# EAGLE design Main_Brd (EAGLE 9.7.0)
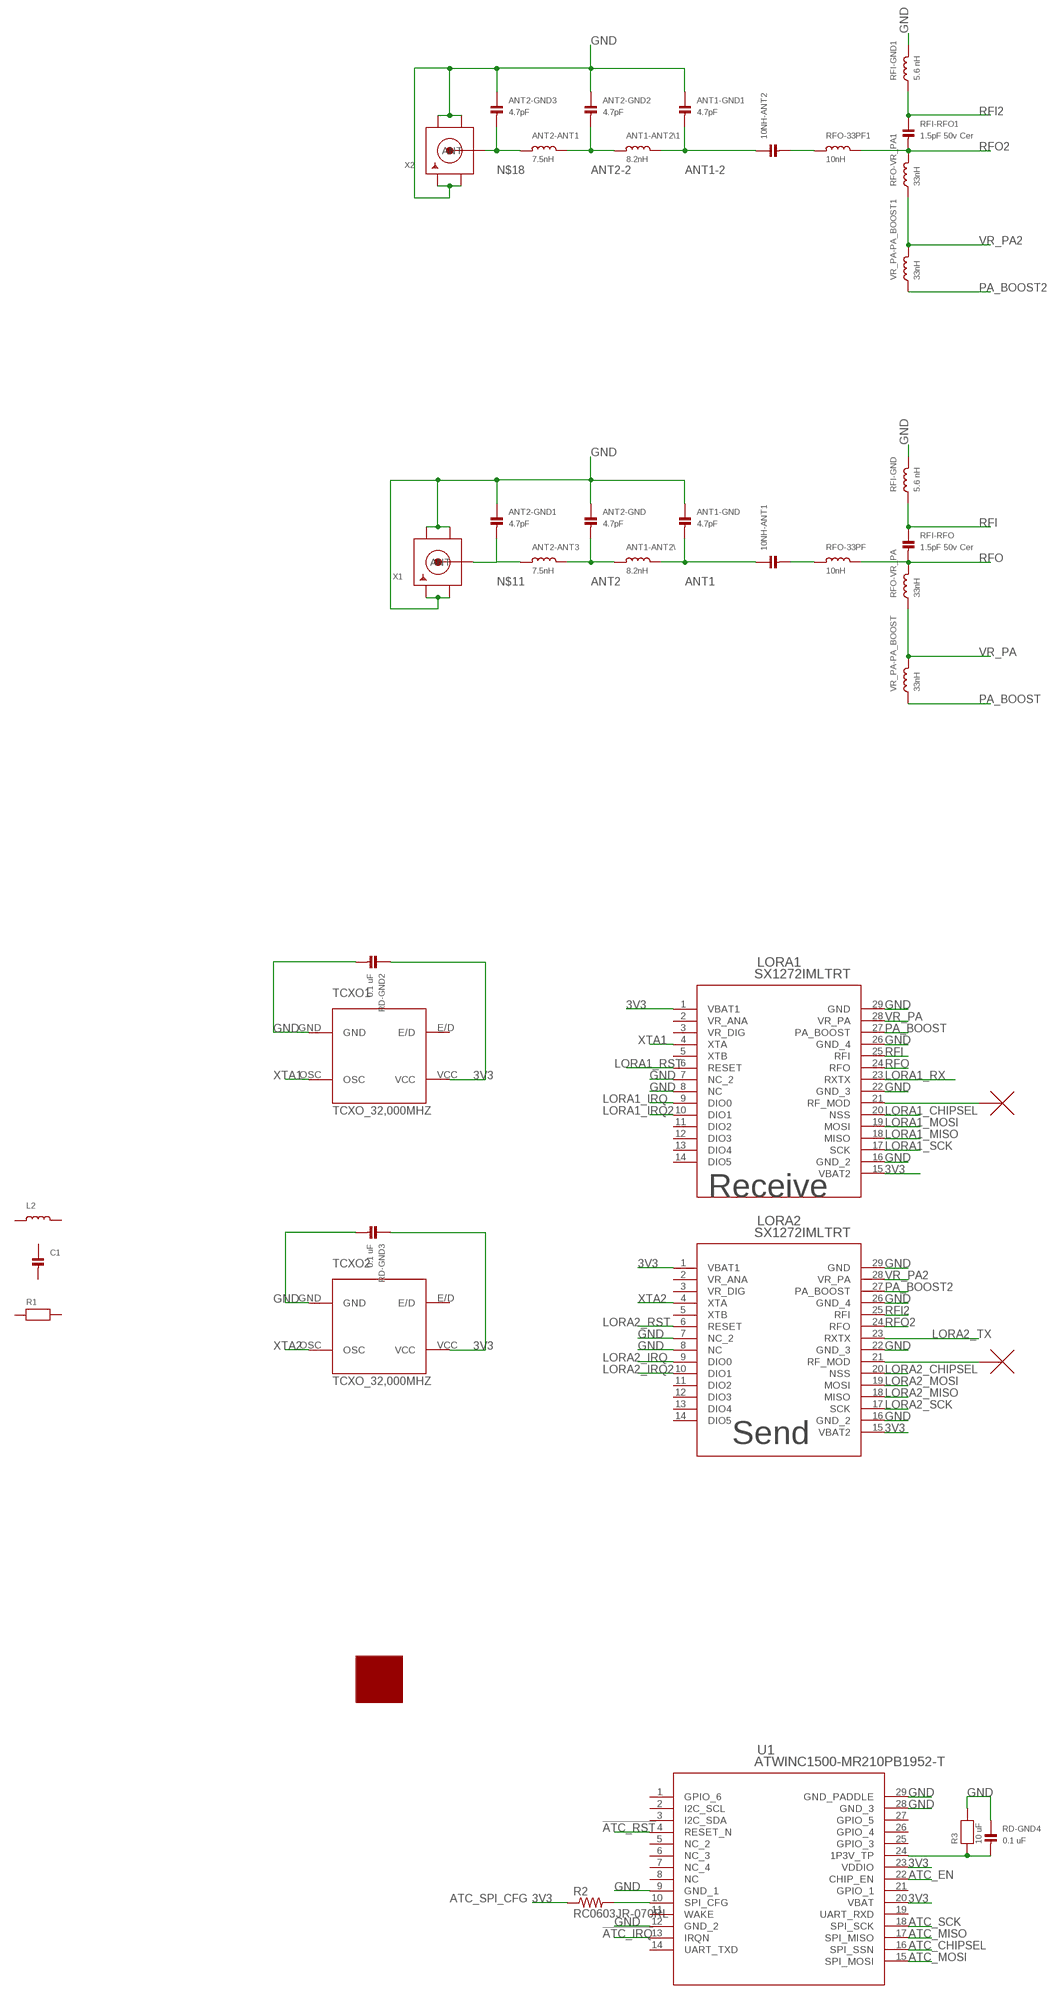
[diagram p0: schematic, sheet 1, part 1 of 2]
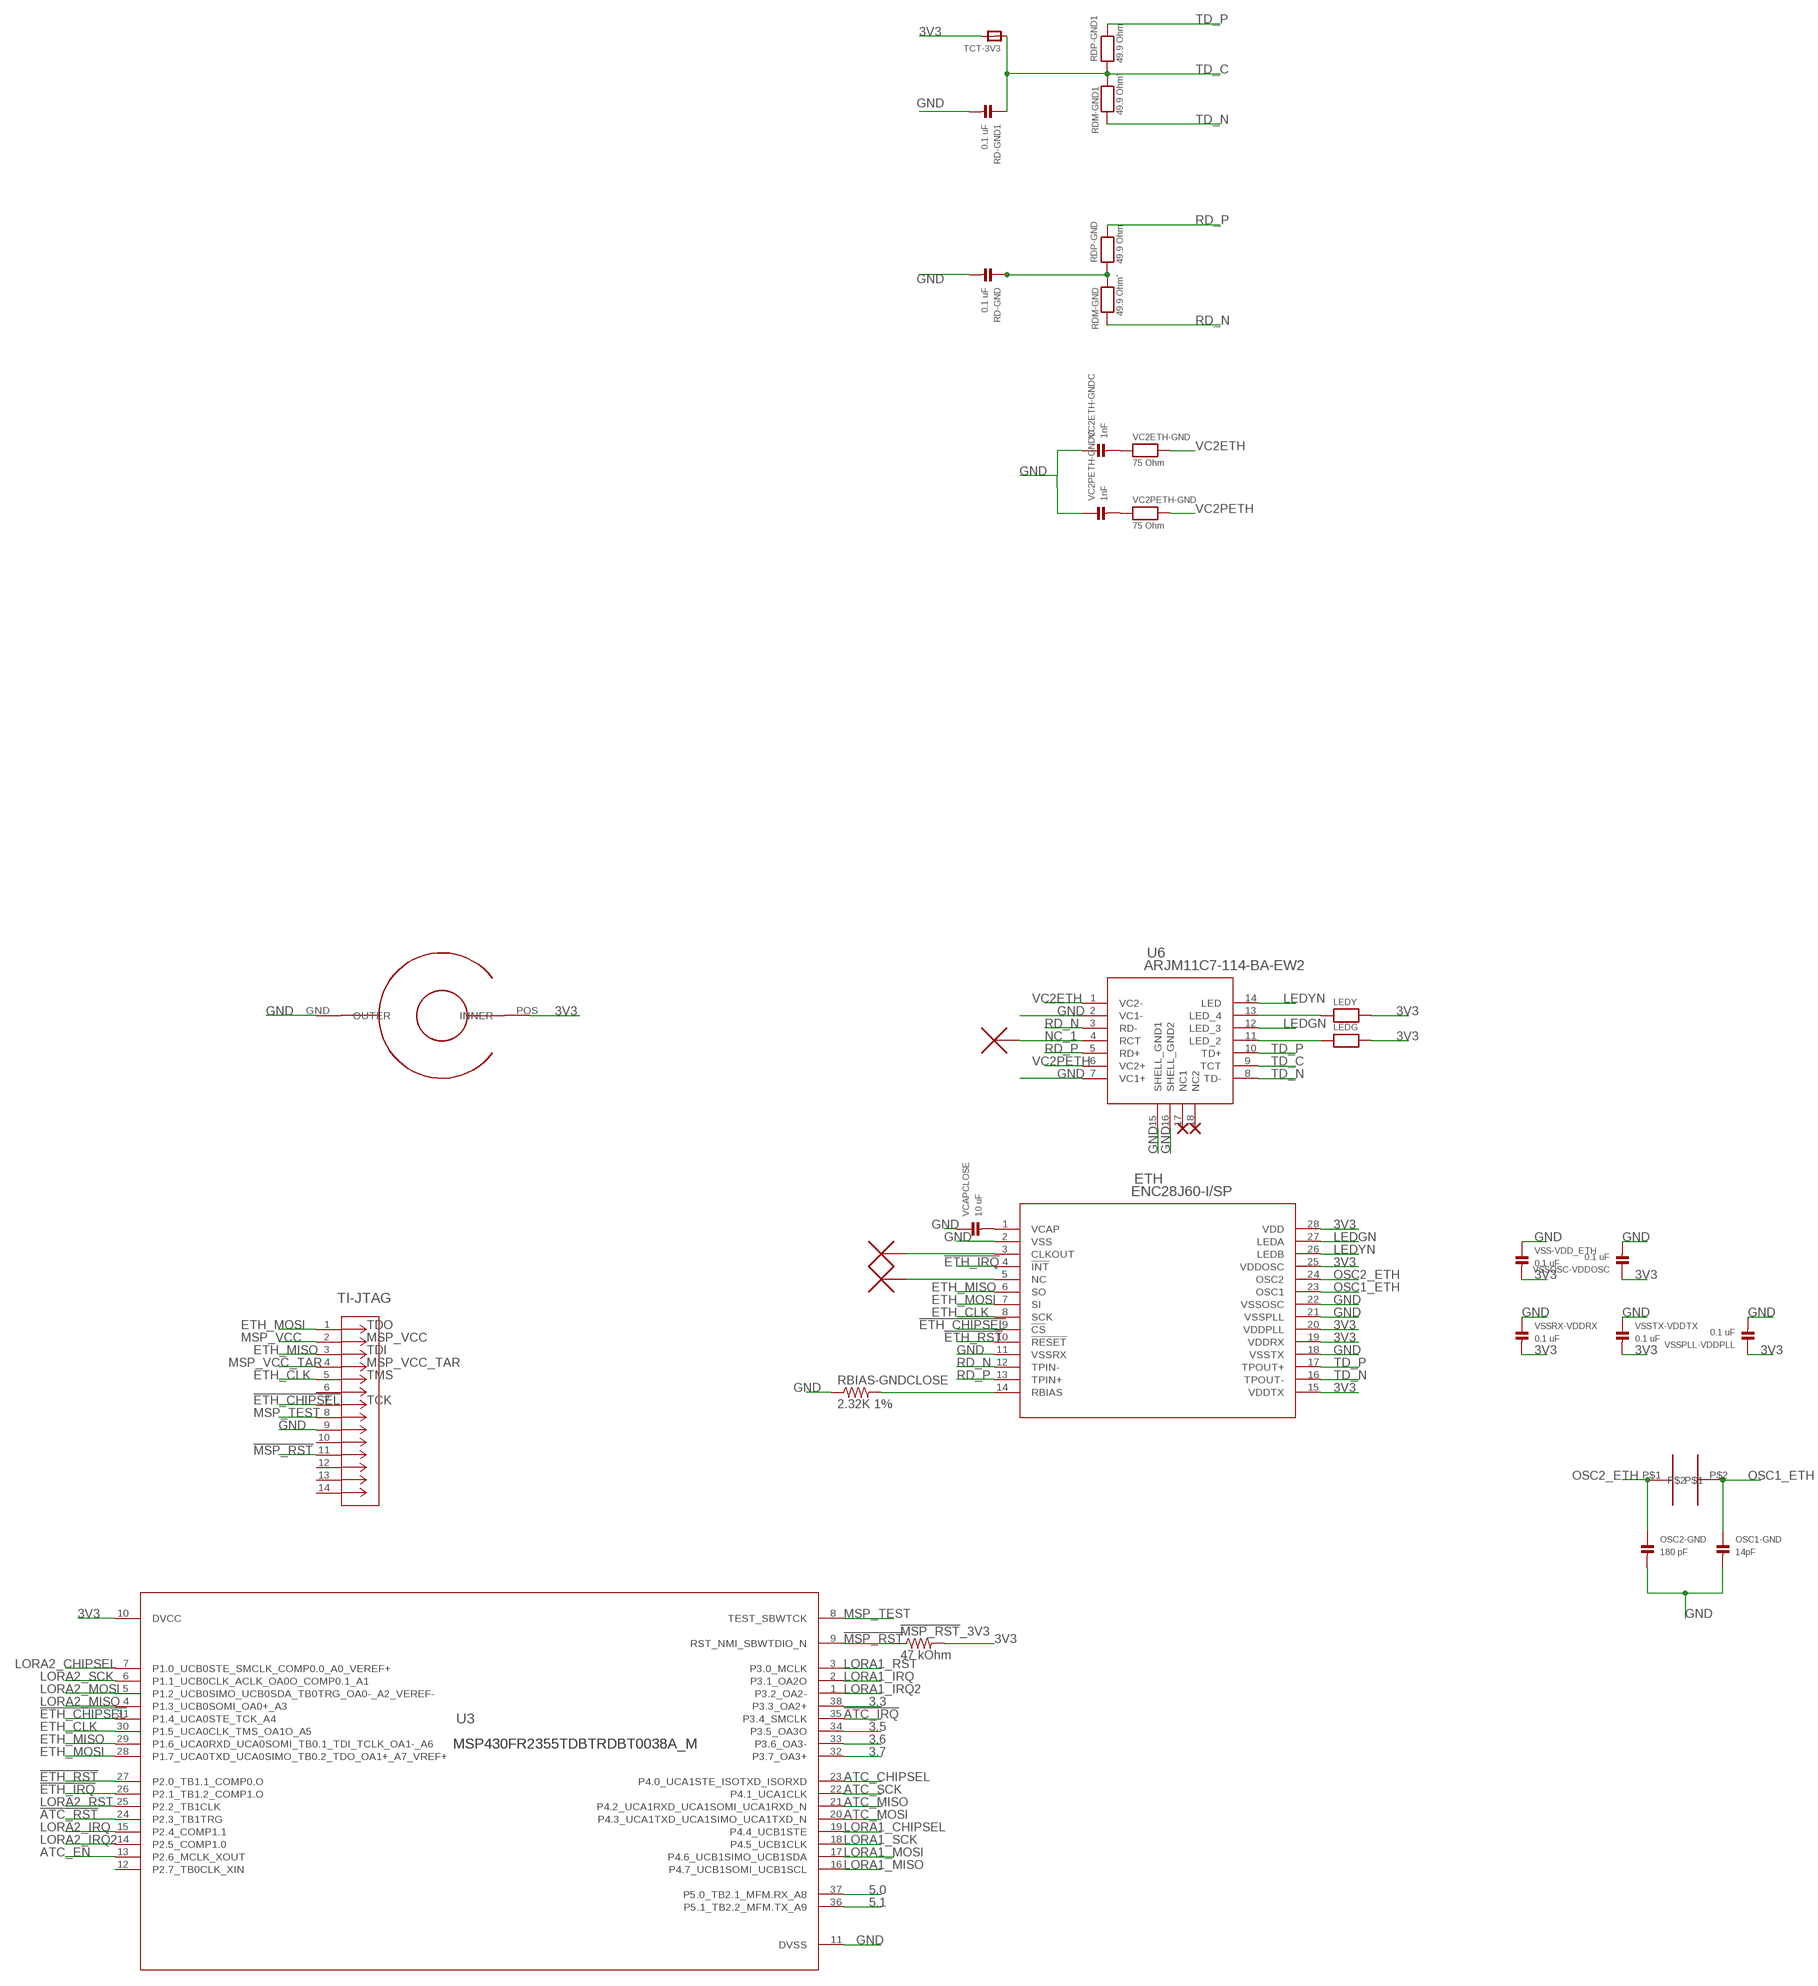
[diagram p1: schematic, sheet 1, part 2 of 2]

## Parts
10NH-ANT1  CAP_CERAMIC0402  [0402]
10NH-ANT2  CAP_CERAMIC0402  [0402]
!MSP_RST!_3V3  47 kOhm  RC0603JR-070RL  [RES_0603]
ANT1-ANT2\  8.2nH  INDUCTOR_0402  [_0402]
ANT1-ANT2\1  8.2nH  INDUCTOR_0402  [_0402]
ANT1-GND  4.7pF  CAP_CERAMIC0402  [0402]
ANT1-GND1  4.7pF  CAP_CERAMIC0402  [0402]
ANT2-ANT1  7.5nH  INDUCTOR_0402  [_0402]
ANT2-ANT3  7.5nH  INDUCTOR_0402  [_0402]
ANT2-GND  4.7pF  CAP_CERAMIC0402  [0402]
ANT2-GND1  4.7pF  CAP_CERAMIC0402  [0402]
ANT2-GND2  4.7pF  CAP_CERAMIC0402  [0402]
ANT2-GND3  4.7pF  CAP_CERAMIC0402  [0402]
C1  CAP_CERAMIC0402  [0402]
ETH  ENC28J60-I/SP  [SPDIP28_300MC_MCH]
L2  INDUCTOR_0402  [_0402]
LEDG  RESISTOR0402  [0402]
LEDY  RESISTOR0402  [0402]
LORA1  SX1272IMLTRT  [QFN28_6X6_SEM]
LORA2  SX1272IMLTRT  [QFN28_6X6_SEM]
OSC1-GND  14pF  CAP_CERAMIC0603  [0603]
OSC2-GND  180 pF  CAP_CERAMIC0603  [0603]
R1  RESISTOR0402  [0402]
R2  RC0603JR-070RL  [RES_0603]
R3  10 uF  RESISTOR2012  [2012]
RBIAS-GNDCLOSE  2.32K 1%  RC0603JR-070RL  [RES_0603]
RD-GND  0.1 uF  CAP_CERAMIC0603  [0603]
RD-GND1  0.1 uF  CAP_CERAMIC0603  [0603]
RD-GND2  0.1 uF  CAP_CERAMIC0603  [0603]
RD-GND3  0.1 uF  CAP_CERAMIC0603  [0603]
RD-GND4  0.1 uF  CAP_CERAMIC0603  [0603]
RDM-GND  49.9 Ohm'  RESISTOR0402  [0402]
RDM-GND1  49.9 Ohm'  RESISTOR0402  [0402]
RDP-GND  49.9 Ohm  RESISTOR0402  [0402]
RDP-GND1  49.9 Ohm  RESISTOR0402  [0402]
RFI-GND  5.6 nH  INDUCTOR_0402  [_0402]
RFI-GND1  5.6 nH  INDUCTOR_0402  [_0402]
RFI-RFO  1.5pF 50v Cer  CAP_CERAMIC0402  [0402]
RFI-RFO1  1.5pF 50v Cer  CAP_CERAMIC0402  [0402]
RFO-33PF  10nH  INDUCTOR_0402  [_0402]
RFO-33PF1  10nH  INDUCTOR_0402  [_0402]
RFO-VR_PA  33nH  INDUCTOR_0402  [_0402]
RFO-VR_PA1  33nH  INDUCTOR_0402  [_0402]
TCT-3V3  FERRITE  [0603]
TCXO1  TCXO_32,000MHZ  [TCXO]
TCXO2  TCXO_32,000MHZ  [TCXO]
TI-JTAG  702461401  [CON_702461401_MOL]
U1  ATWINC1500-MR210PB1952-T  [ATWINC15X0-MR210_MCH]
U3  MSP430FR2355TDBTRDBT0038A_M  [DBT0038A_M]
U6  ARJM11C7-114-BA-EW2  [ARJM11C7-114-BA-EW2_ABR]
U$1  NC_MARKER  (no package)
U$2  J49SMH-P-G-G-K-25M0  [2PAD-11.5X4.8]
U$3  NC_MARKER  (no package)
U$4  NC_MARKER  (no package)
U$5  NC_MARKER  (no package)
U$6  NC_MARKER  (no package)
U$7  BARREL_CONN_EXTERN  [BARREL_CONN_EXTERN]
U$8  MAGICWIFI_X10  [LOGOX10]
VC2ETH-GND  75 Ohm  RESISTOR0402  [0402]
VC2ETH-GNDC  1nF  CAP_CERAMIC0402  [0402]
VC2PETH-GND  75 Ohm  RESISTOR0402  [0402]
VC2PETH-GNDC  1nF  CAP_CERAMIC0402  [0402]
VCAPCLOSE  10 uF  CAP_CERAMIC0805  [0805]
VR_PA-PA_BOOST  33nH  INDUCTOR_0402  [_0402]
VR_PA-PA_BOOST1  33nH  INDUCTOR_0402  [_0402]
VSS-VDD_ETH  0.1 uF  CAP_CERAMIC0603  [0603]
VSSOSC-VDDOSC  0.1 uF  CAP_CERAMIC0603  [0603]
VSSPLL-VDDPLL  0.1 uF  CAP_CERAMIC0603  [0603]
VSSRX-VDDRX  0.1 uF  CAP_CERAMIC0603  [0603]
VSSTX-VDDTX  0.1 uF  CAP_CERAMIC0603  [0603]
X1  SMACONNECTOR_EDGE  [SMA_EDGELAUNCH]
X2  SMACONNECTOR_EDGE  [SMA_EDGELAUNCH]

## Nets
3.3: U3.38(P3.3_OA2+)
3.5: U3.34(P3.5_OA3O)
3.6: U3.33(P3.6_OA3-)
3.7: U3.32(P3.7_OA3+)
3V3: !MSP_RST!_3V3.2 ETH.15(VDDTX) ETH.19(VDDRX) ETH.20(VDDPLL) ETH.25(VDDOSC) ETH.28(VDD) LEDG.2 LEDY.2 LORA1.1(VBAT1) LORA1.15(VBAT2) LORA2.1(VBAT1) LORA2.15(VBAT2) R2.1 RD-GND2.1 RD-GND3.1 TCT-3V3.2 TCXO1.VCC TCXO2.VCC U1.20(VBAT) U1.23(VDDIO) U3.10(DVCC) U$7.POS(INNER) VSS-VDD_ETH.2 VSSOSC-VDDOSC.1 VSSPLL-VDDPLL.1 VSSRX-VDDRX.2 VSSTX-VDDTX.2
5.0: U3.37(P5.0_TB2.1_MFM.RX_A8)
5.1: U3.36(P5.1_TB2.2_MFM.TX_A9)
!ATC_IRQ: U1.13(IRQN) U3.35(P3.4_SMCLK)
!ATC_RST: U1.4(RESET_N) U3.24(P2.3_TB1TRG)
!ETH_CHIPSEL: ETH.9(!CS) TI-JTAG.7 U3.31(P1.4_UCA0STE_TCK_A4)
!ETH_IRQ: ETH.4(!INT) U3.26(P2.1_TB1.2_COMP1.O)
!ETH_RST: ETH.10(!RESET) U3.27(P2.0_TB1.1_COMP0.O)
!MSP_RST: !MSP_RST!_3V3.1 TI-JTAG.11 U3.9(RST_NMI_SBWTDIO_N)
ANT1: 10NH-ANT1.1 ANT1-ANT2\.2 ANT1-GND.2
ANT1-2: 10NH-ANT2.1 ANT1-ANT2\1.2 ANT1-GND1.2
ANT2: ANT1-ANT2\.1 ANT2-ANT3.2 ANT2-GND.2
ANT2-2: ANT1-ANT2\1.1 ANT2-ANT1.2 ANT2-GND2.2
ATC_CHIPSEL: U1.16(SPI_SSN) U3.23(P4.0_UCA1STE_ISOTXD_ISORXD)
ATC_EN: U1.22(CHIP_EN) U3.13(P2.6_MCLK_XOUT)
ATC_MISO: U1.17(SPI_MISO) U3.21(P4.2_UCA1RXD_UCA1SOMI_UCA1RXD_N)
ATC_MOSI: U1.15(SPI_MOSI) U3.20(P4.3_UCA1TXD_UCA1SIMO_UCA1TXD_N)
ATC_SCK: U1.18(SPI_SCK) U3.22(P4.1_UCA1CLK)
ATC_SPI_CFG: R2.2 U1.10(SPI_CFG)
ETH_CLK: ETH.8(SCK) TI-JTAG.5 U3.30(P1.5_UCA0CLK_TMS_OA1O_A5)
ETH_MISO: ETH.6(SO) TI-JTAG.3 U3.29(P1.6_UCA0RXD_UCA0SOMI_TB0.1_TDI_TCLK_OA1-_A6)
ETH_MOSI: ETH.7(SI) TI-JTAG.1 U3.28(P1.7_UCA0TXD_UCA0SIMO_TB0.2_TDO_OA1+_A7_VREF+)
GND: ANT1-GND1.1 ANT1-GND.1 ANT2-GND1.1 ANT2-GND2.1 ANT2-GND3.1 ANT2-GND.1 ETH.2(VSS) ETH.11(VSSRX) ETH.18(VSSTX) ETH.21(VSSPLL) ETH.22(VSSOSC) LORA1.7(NC_2) LORA1.8(NC) LORA1.16(GND_2) LORA1.22(GND_3) LORA1.26(GND_4) LORA1.29(GND) LORA2.7(NC_2) LORA2.8(NC) LORA2.16(GND_2) LORA2.22(GND_3) LORA2.26(GND_4) LORA2.29(GND) OSC1-GND.2 OSC2-GND.2 R3.2 RBIAS-GNDCLOSE.1 RD-GND1.2 RD-GND2.2 RD-GND3.2 RD-GND4.1 RD-GND.2 RFI-GND1.2 RFI-GND.2 TCXO1.GND TCXO2.GND TI-JTAG.9 U1.9(GND_1) U1.12(GND_2) U1.28(GND_3) U1.29(GND_PADDLE) U3.11(DVSS) U6.2(VC1-) U6.7(VC1+) U6.15(SHELL_GND1) U6.16(SHELL_GND2) U$7.GND(OUTER) VC2ETH-GNDC.1 VC2PETH-GNDC.1 VCAPCLOSE.1 VSS-VDD_ETH.1 VSSOSC-VDDOSC.2 VSSPLL-VDDPLL.2 VSSRX-VDDRX.1 VSSTX-VDDTX.1 X1.GND@1(GND4) X1.GND@2(GND3) X1.GND@3(GND2) X1.GND@4(GND1) X2.GND@1(GND4) X2.GND@2(GND3) X2.GND@3(GND2) X2.GND@4(GND1)
LEDGN: ETH.27(LEDA) U6.12(LED_3)
LEDYN: ETH.26(LEDB) U6.14(LED)
LORA1_CHIPSEL: LORA1.20(NSS) U3.19(P4.4_UCB1STE)
LORA1_IRQ: LORA1.9(DIO0) U3.2(P3.1_OA2O)
LORA1_IRQ2: LORA1.10(DIO1) U3.1(P3.2_OA2-)
LORA1_MISO: LORA1.18(MISO) U3.16(P4.7_UCB1SOMI_UCB1SCL)
LORA1_MOSI: LORA1.19(MOSI) U3.17(P4.6_UCB1SIMO_UCB1SDA)
LORA1_RST: LORA1.6(RESET) U3.3(P3.0_MCLK)
LORA1_RX: LORA1.23(RXTX)
LORA1_SCK: LORA1.17(SCK) U3.18(P4.5_UCB1CLK)
LORA2_CHIPSEL: LORA2.20(NSS) U3.7(P1.0_UCB0STE_SMCLK_COMP0.0_A0_VEREF+)
LORA2_IRQ: LORA2.9(DIO0) U3.15(P2.4_COMP1.1)
LORA2_IRQ2: LORA2.10(DIO1) U3.14(P2.5_COMP1.0)
LORA2_MISO: LORA2.18(MISO) U3.4(P1.3_UCB0SOMI_OA0+_A3)
LORA2_MOSI: LORA2.19(MOSI) U3.5(P1.2_UCB0SIMO_UCB0SDA_TB0TRG_OA0-_A2_VEREF-)
LORA2_RST: LORA2.6(RESET) U3.25(P2.2_TB1CLK)
LORA2_SCK: LORA2.17(SCK) U3.6(P1.1_UCB0CLK_ACLK_OA0O_COMP0.1_A1)
LORA2_TX: LORA2.23(RXTX)
MSP_TEST: TI-JTAG.8 U3.8(TEST_SBWTCK)
MSP_VCC: TI-JTAG.2
MSP_VCC_TAR: TI-JTAG.4
N$1: 10NH-ANT1.2 RFO-33PF.1
N$2: 10NH-ANT2.2 RFO-33PF1.1
N$3: LORA1.21(RF_MOD) U$6.P$1
N$4: ETH.1(VCAP) VCAPCLOSE.2
N$5: VC2ETH-GND.1 VC2ETH-GNDC.2
N$6: VC2PETH-GND.1 VC2PETH-GNDC.2
N$7: LEDY.1 U6.13(LED_4)
N$8: RD-GND.1 RDM-GND.1 RDP-GND.1
N$9: LEDG.1 U6.11(LED_2)
N$10: ETH.14(RBIAS) RBIAS-GNDCLOSE.2
N$11: ANT2-ANT3.1 ANT2-GND1.2 X1.P(ANT)
N$12: LORA2.21(RF_MOD) U$5.P$1
N$13: R3.1 RD-GND4.2 U1.24(1P3V_TP)
N$14: ETH.5(NC) U$3.P$1
N$15: ETH.3(CLKOUT) U$4.P$1
N$18: ANT2-ANT1.1 ANT2-GND3.2 X2.P(ANT)
NC_1: U6.4(RCT) U$1.P$1
OSC1_ETH: ETH.23(OSC1) OSC1-GND.1 U$2.P$2
OSC2_ETH: ETH.24(OSC2) OSC2-GND.1 U$2.P$1
PA_BOOST: LORA1.27(PA_BOOST) VR_PA-PA_BOOST.1
PA_BOOST2: LORA2.27(PA_BOOST) VR_PA-PA_BOOST1.1
RD_N: ETH.12(TPIN-) RDM-GND.2 U6.3(RD-)
RD_P: ETH.13(TPIN+) RDP-GND.2 U6.5(RD+)
RFI: LORA1.25(RFI) RFI-GND.1 RFI-RFO.1
RFI2: LORA2.25(RFI) RFI-GND1.1 RFI-RFO1.1
RFO: LORA1.24(RFO) RFI-RFO.2 RFO-33PF.2 RFO-VR_PA.2
RFO2: LORA2.24(RFO) RFI-RFO1.2 RFO-33PF1.2 RFO-VR_PA1.2
TD_C: RD-GND1.1 RDM-GND1.1 RDP-GND1.1 TCT-3V3.1 U6.9(TCT)
TD_N: ETH.16(TPOUT-) RDM-GND1.2 U6.8(TD-)
TD_P: ETH.17(TPOUT+) RDP-GND1.2 U6.10(TD+)
VC2ETH: U6.1(VC2-) VC2ETH-GND.2
VC2PETH: U6.6(VC2+) VC2PETH-GND.2
VR_PA: LORA1.28(VR_PA) RFO-VR_PA.1 VR_PA-PA_BOOST.2
VR_PA2: LORA2.28(VR_PA) RFO-VR_PA1.1 VR_PA-PA_BOOST1.2
XTA1: LORA1.4(XTA) TCXO1.OSC
XTA2: LORA2.4(XTA) TCXO2.OSC
Unconnected: C1.1 C1.2 L2.1 L2.2 LORA1.5(XTB) LORA1.11(DIO2) LORA1.12(DIO3) LORA1.13(DIO4) LORA1.14(DIO5) LORA2.5(XTB) LORA2.11(DIO2) LORA2.12(DIO3) LORA2.13(DIO4) LORA2.14(DIO5) R1.1 R1.2 TCXO1.E/D TCXO2.E/D TI-JTAG.6 TI-JTAG.10 TI-JTAG.12 TI-JTAG.13 TI-JTAG.14 U1.1(GPIO_6) U1.2(I2C_SCL) U1.3(I2C_SDA) U1.5(NC_2) U1.6(NC_3) U1.7(NC_4) U1.8(NC) U1.11(WAKE) U1.14(UART_TXD) U1.19(UART_RXD) U1.21(GPIO_1) U1.25(GPIO_3) U1.26(GPIO_4) U1.27(GPIO_5) U3.12(P2.7_TB0CLK_XIN) U6.17(NC1) U6.18(NC2)

## Notes on the sheet
- Receive
- TDO
- MSP_VCC
- TDI
- MSP_VCC_TAR
- TMS
- TCK
- Send

## Power pins joined to a net without a drawn wire
VR_ANA: LORA1.2(VR_ANA) LORA2.2(VR_ANA)
VR_DIG: LORA1.3(VR_DIG) LORA2.3(VR_DIG)

## Library data of the parts
10NH-ANT1 10NH-ANT2 ANT1-GND ANT1-GND1 ANT2-GND ANT2-GND1-ANT2-GND3 C1 OSC1-GND OSC2-GND RD-GND RD-GND1-RD-GND4 RFI-RFO RFI-RFO1 VC2ETH-GNDC VC2PETH-GNDC VCAPCLOSE VSS-VDD_ETH VSSOSC-VDDOSC VSSPLL-VDDPLL VSSRX-VDDRX VSSTX-VDDTX = microbuilder:CAP_CERAMIC: Ceramic Capacitors 0402 - 0402 Surface Mount Capacitors 16pF 50V 5% [Digikey: 445-4899-2-ND] 18pF 50V 5% [Digikey: 490-1281-2-ND] 22pF 50V 5% [Digikey: 490-1283-2-ND] 68pF 50V 5% [Digikey: 490-1289-2-ND] 0.1uF 10V 10% [Digikey: 490-1318-2-ND] 1.0uF 6.3V 10% [Digikey: 490-1320-2-ND] 0603 - 0603 Surface Mount Capacitors 16 pF 50V 5% [Digikey: 445-5051-2-ND] 22 pF 50V [Digikey: PCC220ACVTR-ND] 33 pF 50V 5% [Digikey: 490-1415-1-ND] 56pF 50V 5% [Digikey: 490-1421-1-ND] 220pF 50V 5% [Digikey: 445-1285-1-ND] 680 pF 50V 2200 pF 50V 5% C0G [Digikey: 445-1297-1-ND] 5600 pF 100V 5% X7R [Digikey: 478-3711-1-ND] 0.1 µF 25V 10% [Digikey: PCC2277TR-ND] 0.22 µF 16V 10% X7R [Digikey: 445-1318-1-ND] 1.0 µF 25V 10% [Digikey: 445-5146-2-ND] 0603 - RF Specific 3pF 250V +/-0.1pF RF [Digikey: 712-1347-1-ND] 18 pF 250V 5% [Digikey: 478-3505-1-ND or 712-1322-1-ND] 56 pF 250V 5% C0G RF [Digikey: 490-4867-1-ND] 68 pF 250V RF [Digikey: 490-4868-1-ND] 0805 - 0805 Surface Mount Capacitors 220 pF 250V 2% RF Ceramic Capacitor [Digikey: 712-1398-1-ND] 1000 pF 50V 2% NP0 Ceramic Capacitor [Digikey: 478-3760-1-ND] 0.1 µF 25V 10% Ceramic Capacitor [Digikey: PCC1828TR-ND] 1.0 µF 16V 10% Ceramic Capacitor[Digikey: 490-1691-2-ND] 10.0 µF 10V 10% Ceramic Capacitor[Digikey: 709-1228-1-ND] 10.0 uF 16V 10% Ceramic Capacitor [Digikey: 478-5165-2-ND] 47 uF 6.3V 20% Ceramic Capacitor [Digikey: 587-1779-1-ND or 399-5506-1-ND] 1206 - 1206 Surface Mount Capacitors 47uF 10V 20% Ceramic Capacitor [Digikey: 490-5528-1-ND or 399-5508-1-ND or 445-6010-1-ND] 100uF 6.3V -20%, +80% Y5V Ceramic Capacitor (Digikey: 490-4512-1-ND, Mouser: 81-GRM31CF50J107ZE1L)
!MSP_RST!_3V3 R2 RBIAS-GNDCLOSE = Resistor_Capacitor:RC0603JR-070RL: RES SMD 0 OHM JUMPER 1/10W 0603 Manufacturer's datasheet <http://www.yageo.com/documents/recent/PYu-RC_Group_51_RoHS_L_10.pdf>; CREATED_BY: PCBLayout.com; DIGIKEY_PART_NUMBER: 311-0.0GRTR-ND; MANUFACTURER: Yageo; MPN: RC0603JR-070RL; PACKAGE: SMD 0603
ANT1-ANT2\ ANT1-ANT2\1 ANT2-ANT1 ANT2-ANT3 L2 RFI-GND RFI-GND1 RFO-33PF RFO-33PF1 RFO-VR_PA RFO-VR_PA1 VR_PA-PA_BOOST VR_PA-PA_BOOST1 = microbuilder:INDUCTOR: Inductors 0603: 10nH Ceramic Inductor - microwire antenna/RF (Digikey: 712-1434-2-ND) 0805: 560nH Ceramic Inductor - RF (Digikey: 553-1047-1-ND) 270nH Ceramic Inductor - Q = 40@250MHz, +-5%, 1 Ohm DC Resistance (Digikey: 535-10506-2-ND) 1007 (2518 Metric) SMT: 10µH 10% 250mOhm 820mA 1007 Inductor (Digikey: 587-2189-1-ND) 22µH 10% 500mOhm 580mA 1007 Inductor (Digikey: 587-2190-1-ND) 47µH 10% 950mOhm 420mA 1007 Inductor (Digikey: 587-2191-1-ND) 47µH 5% 100mOhm 1A 1008 Inductor (Digikey: 732-1816-1-ND) 5.0x5.0mm (Taiyo Yuden NR5040 Series) 6.8µH 20% 2.3A 64mOhm Inductor (Digikey: 587-2374-2-ND) 5.0x5.0mm (TDK VLC5045 Series) 4.7µH 20% 3.3A 34mOhm Inductor (Digikey: 445-6526-1-ND) 6.8µH 20% 2.7A 46mOhm Inductor (Digikey: 445-6527-1-ND) 6.0x6.0mm (TDK VLC6045 Series) 4.7µH 20% 3.8A 27mOhm Inductor (Digikey: 445-6538-2-ND) 6.8µH 20% 3A 41mOhm Inductor (Digikey: 445-6540-1-ND) 6.2µH 30% 2.2A 45mOhm Inductor (Digikey: SRR5028-6R2YCT-ND) - Not TDK VLC6045 but footprint should match 6.0x6.0mm (TDK SLF6045 Series) 6.8uH 30% 2A 33mOhm Inductor (Digikey: 445-4572-1-ND, Mouser: 810-SLF645T6R8N2R0PF)
ETH = 473:ENC28J60-I/SP; COPYRIGHT: Copyright (C) 2022 Ultra Librarian. All rights reserved.; MANUFACTURER_PART_NUMBER: ENC28J60-I/SP; MFR_NAME: Microchip
LEDG LEDY R1 R3 RDM-GND RDM-GND1 RDP-GND RDP-GND1 VC2ETH-GND VC2PETH-GND = microbuilder:RESISTOR: Resistors 0402 - 0402 Surface Mount Package 22 Ohm 1% 1/16W [Digikey: 311-22.0LRTR-ND] 33 Ohm 5% 1/16W 1.0K 5% 1/16W 1.5K 5% 1/16W 2.0K 1% 1/16W 10.0K 1% 1/16W [Digikey: 311-10.0KLRTR-ND] 10.0K 5% 1/16W [Digikey: RMCF0402JT10K0TR-ND] 12.1K 1% 1/16W [Digikey: 311-22.0LRTR-ND] 100.0K 5% 1/16W 0603 - 0603 Surface Mount Package 0 Ohm 1/10 Watt 1% Resistor 15 Ohm 1/10 Watt 1% Resistor 33 Ohm 1/10 Watt 1% Resistor 49.9 Ohm 1/10 Watt 1% Resistor 100 Ohm 1/10 Watt 1% Resistor 150 Ohm 1/10 Watt 1% Resistor 240 Ohm 1/10 Watt 1% Resistor 390 Ohm 1/10 Watt 1% Resistor 560 Ohm 1/10 Watt 1% Resistor 680 Ohm 1/10 Watt 1% Resistor 750 Ohm 1/10 Watt 1% Resistor 1.0K Ohm 1/10 Watt 1% Resistor 1.5K Ohm 1/10 Watt 1% Resistor 2.0K Ohm 1/10 Watt 1% Resistor 2.2K Ohm 1/10 Watt 1% Resistor 3.3K Ohm 1/10 Watt 1% Resistor 4.7K Ohm 1/10 Watt 1% Resistor 10.0K Ohm 1/10 Watt 1% Resistor 12.0K Ohm 1/10 Watt 1% Resistor 12.1K Ohm 1/10 Watt 1% Resistor 20.0K Ohm 1/10 Watt 1% Resistor 33.0K Ohm 1/10 Watt 1% Resistor 100.0K Ohm 1/10 Watt 1% Resistor 0805 - 0805 Surface Mount Package 0 Ohm 1/8 Watt 1% Resistor 33 Ohm 1/8 Watt 1% Resistor 100 Ohm 1/8 Watt 1% Resistor 150 Ohm 1/8 Watt 1% Resistor 200 Ohm 1/8 Watt 1% Resistor 240 Ohm 1/8 Watt 1% Resistor 330 Ohm 1/8 Watt 1% Resistor 390 Ohm 1/8 Watt 1% Resistor 470 Ohm 1/8 Watt 1% Resistor 1.0K Ohm 1/8 Watt 1% Resistor 1.5K Ohm 1/8 Watt 1% Resistor 2.0K Ohm 1/8 Watt 1% Resistor 4.7K Ohm 1/8 Watt 1% Resistor 5.1K Ohm 1/8 Watt 1% Resistor 5.6K Ohm 1/8 Watt 1% Resistor 10.0K Ohm 1/8 Watt 1% Resistor 22.0K Ohm 1/8 Watt 1% Resistor 33.0K Ohm 1/8 Watt 1% Resistor 100K Ohm 1/8 Watt 1% Resistor 1206 - 1206 Surface Mount Package 2012 - 2010 Surface Mount Package 0.11 Ohm 1/2 Watt 1% Resistor - Digikey: RHM.11UCT-ND
LORA1 LORA2 = 473:SX1272IMLTRT; COPYRIGHT: Copyright (C) 2022 Ultra Librarian. All rights reserved.; DIGI-KEY_PART_NUMBER_1: SX1272IMLTRTTR-ND; DIGI-KEY_PART_NUMBER_2: SX1272IMLTRTCT-ND; DIGI-KEY_PART_NUMBER_3: SX1272IMLTRTDKR-ND; MANUFACTURER_PART_NUMBER: SX1272IMLTRT; MFR_NAME: Semtech
TCT-3V3 = microbuilder:FERRITE: Ferrite Bead 0603 MMZ1608B121C - 120 Ohm @ 100MHz, 600mA, 0.15 Ohm DC Resistance - Digikey: 445-2164-1-ND BK1608HW121-T - 120 Ohm, 600mA Ferrite Chip - Digikey: 587-1876-2-ND 0805 HZ0805B272R-10 - 2.7K Ohm @ 100MHz, 200mA, 0.8 Ohm DC Resistance - Digikey: 240-2504-1-ND (see also Murata BLM21BD272SN1L) MMZ2012Y152B - 1.5K Ohm @ 100MHz, 500mA, 0.4 Ohm DC Resistance - Digikey: 445-1560-1-ND - Mainly for high frequency (80-400MHz) MMZ2012R102A - 1K Ohm @ 100MHz, 500mA, 0.3 Ohm DC Resistance - Digikey: 445-1555-2-ND - More general purpose (10-200MHz)
TCXO1 TCXO2 = 473:TCXO_32,000MHZ
TI-JTAG = 473:702461401: A connector for TI JTAG 14 built into the MSP430 chipset.; COPYRIGHT: Copyright (C) 2022 Ultra Librarian. All rights reserved.; MANUFACTURER_PART_NUMBER: 702461401; MFR_NAME: Molex Connector Corporation
U1 = 473:ATWINC1500-MR210PB1952-T; COPYRIGHT: Copyright (C) 2022 Ultra Librarian. All rights reserved.; DIGI-KEY_PART_NUMBER_1: ATWINC1500-MR210PB1952-TTR-ND; DIGI-KEY_PART_NUMBER_2: ATWINC1500-MR210PB1952-TCT-ND; DIGI-KEY_PART_NUMBER_3: ATWINC1500-MR210PB1952-TDKR-ND; MANUFACTURER_PART_NUMBER: ATWINC1500-MR210PB1952-T; MFR_NAME: Microchip
U3 = 473:MSP430FR2355TDBTR; COPYRIGHT: Copyright (C) 2022 Ultra Librarian. All rights reserved.; DIGI-KEY_PART_NUMBER_1: 296-50259-1-ND; DIGI-KEY_PART_NUMBER_2: 296-50259-2-ND; DIGI-KEY_PART_NUMBER_3: 296-50259-6-ND; MANUFACTURER_PART_NUMBER: MSP430FR2355TDBTR; MFR_NAME: Texas Instruments; REFDES: RefDes; TYPE: TYPE
U6 = 473:ARJM11C7-114-BA-EW2; COPYRIGHT: Copyright (C) 2022 Ultra Librarian. All rights reserved.; DIGI-KEY_PART_NUMBER_1: 2266-ARJM11C7-114-BA-EW2-ND; DIGI-KEY_PART_NUMBER_2: 535-14168-ND; MANUFACTURER_PART_NUMBER: ARJM11C7-114-BA-EW2; MFR_NAME: Abracon
U$1 U$3-U$6 = NC_MARKER:NC_MARKER
U$2 = 473:J49SMH-P-G-G-K-25M0: A 25 MHz Crystal Oscillator with 30 pF load capacitance. In a HC-49 US Case Package.
U$7 = 473:BARREL_CONN_EXTERN
U$8 = 473:MAGICWIFI_X10
X1 X2 = adafruit:SMACONNECTOR: SMA Connector 90° DIP SMA Connector, 50 Ohm (4UConnector: 07259)

## Board
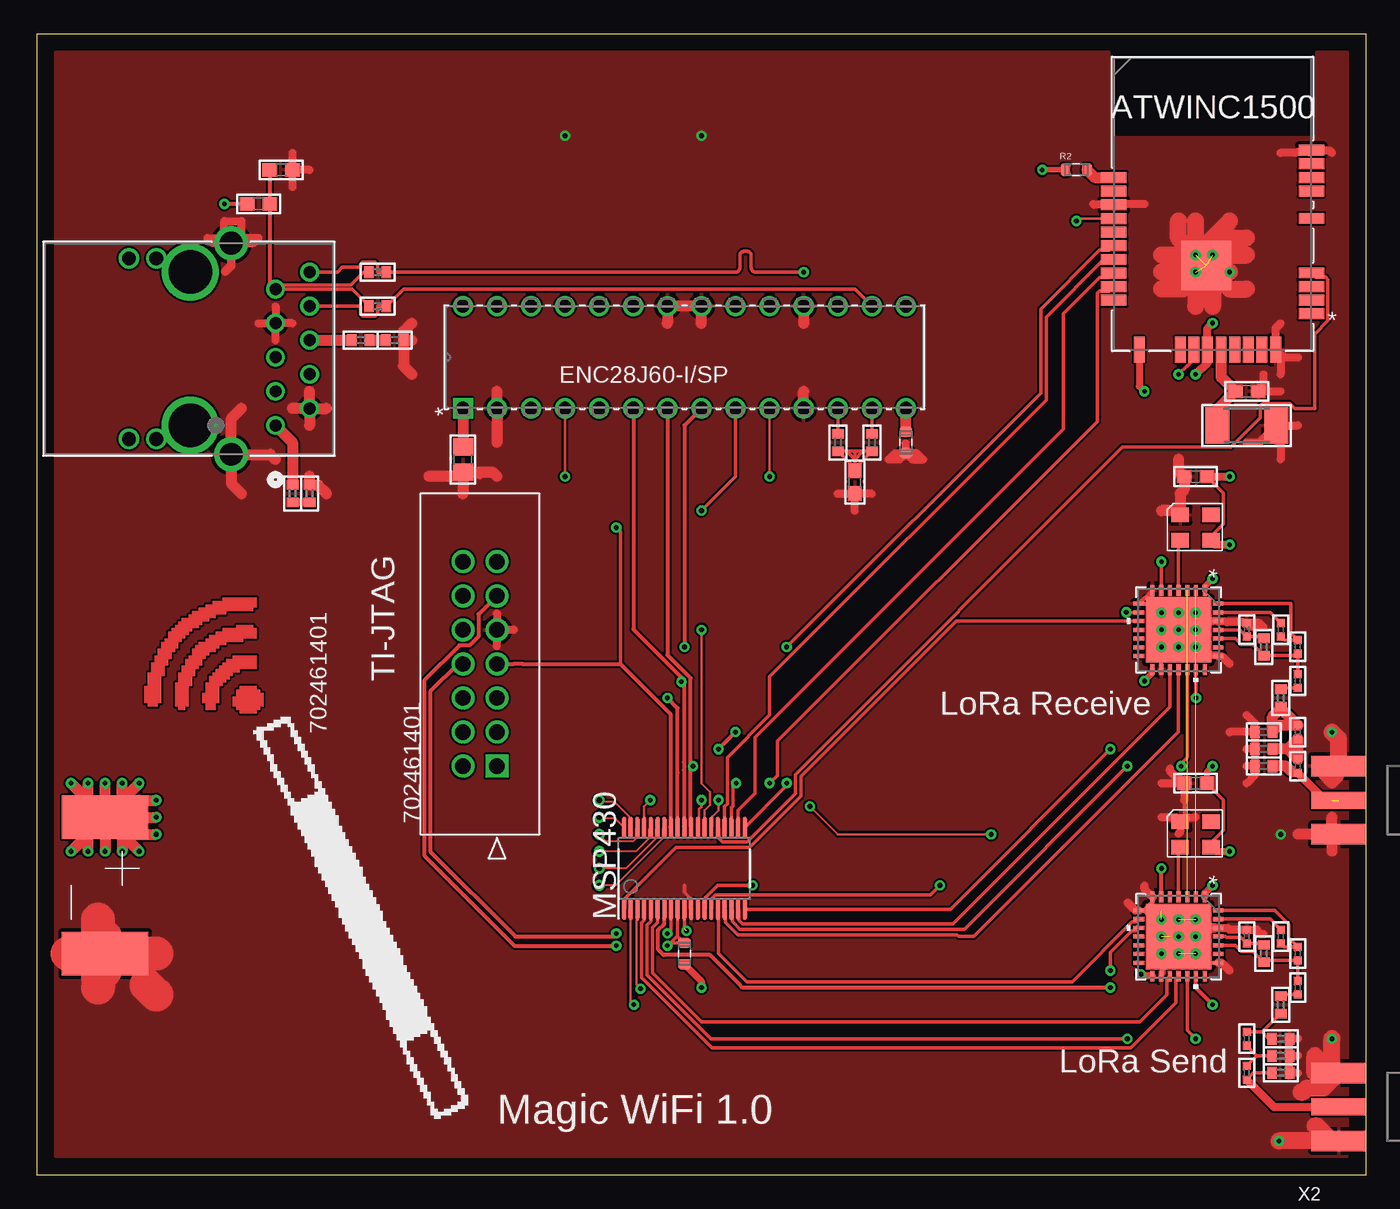
[diagram p2: board, top side]
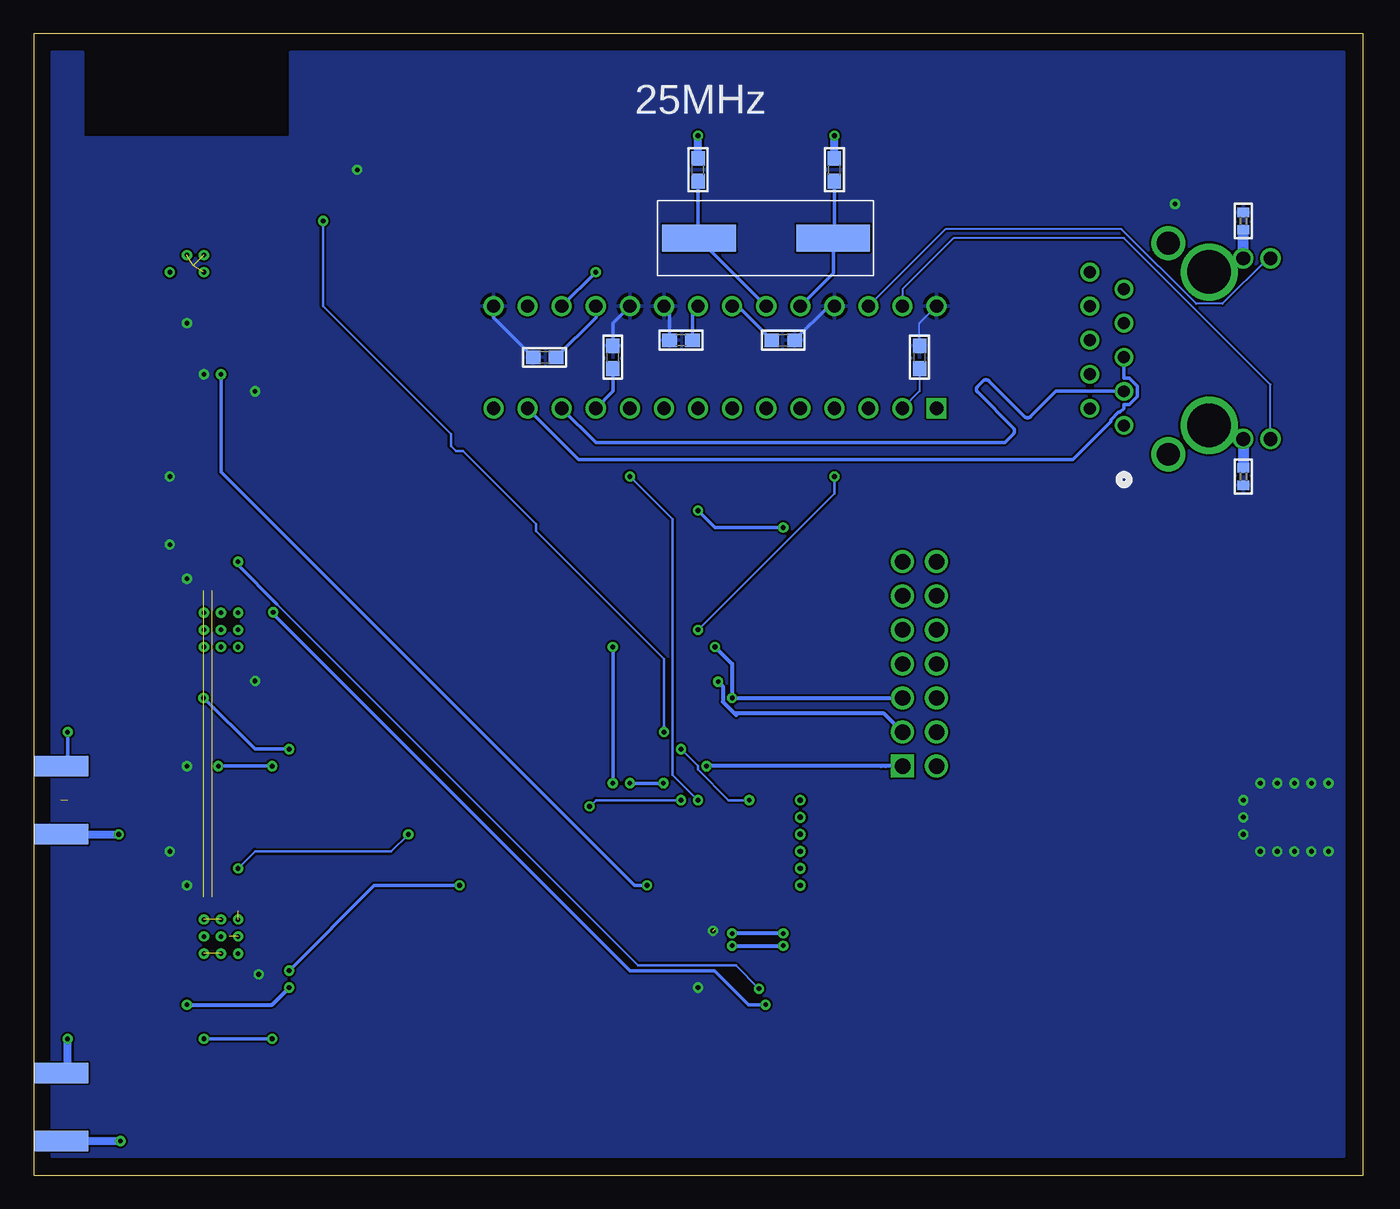
[diagram p3: board, bottom side, seen from below]

Size 99.06 x 85.09 mm. Coordinates in mm from the lower left corner, seen from the top.
Outline: 0,85.09 0,0 99.06,0 99.06,85.09 0,85.09
Copper layers (1*16): Top 0.035mm / dielectric 1.5mm / Bottom 0.035mm
Design rules "default *": minimum track width 6mil, minimum drill 0.35mm, track to track 6mil, track to pad 6mil, pad to pad 6mil, via to via 6mil, smd to smd 6mil, copper to edge 40mil, drill to drill 6mil, minimum pad ring 10mil, minimum via ring 8mil, stop-mask expansion 4mil, vias tented up to drill 14mil, thermal gap 10mil
tKeepout: area 30.5,58.4 to 66,63.5; area 80,77.5 to 95.2,83.8
bKeepout: area 80,77.5 to 95.2,83.8

### Footprints (pad centres in the part's own frame; a part is rotated, then mirrored left to right if it is on the bottom)
0402 = smd 0.7 x 0.9: 1 -0.65,0; 2 0.65,0
RES_0603 = smd 0.74 x 0.93: 1 -0.795,0; 2 0.795,0
_0402 = smd 0.6 x 0.6: 1 -0.508,0; 2 0.508,0
SPDIP28_300MC_MCH = drill 0.991 pad 1.499 square: 1 0,0 | drill 0.991 pad 1.499: 2 0,-2.54; 3 0,-5.08; 4 0,-7.62; 5 0,-10.16; 6 0,-12.7; 7 0,-15.24; 8 0,-17.78; 9 0,-20.32; 10 0,-22.86; 11 0,-25.4; 12 0,-27.94; 13 0,-30.48; 14 0,-33.02; 15 7.62,-33.02; 16 7.62,-30.48; 17 7.62,-27.94; 18 7.62,-25.4; 19 7.62,-22.86; 20 7.62,-20.32; 21 7.62,-17.78; 22 7.62,-15.24; 23 7.62,-12.7; 24 7.62,-10.16; 25 7.62,-7.62; 26 7.62,-5.08; 27 7.62,-2.54; 28 7.62,0
QFN28_6X6_SEM = smd 0.813 x 0.305: 1 -2.946,1.95; 2 -2.946,1.3; 3 -2.946,0.65; 4 -2.946,0; 5 -2.946,-0.65; 6 -2.946,-1.3; 7 -2.946,-1.95; 15 2.946,-1.95; 16 2.946,-1.3; 17 2.946,-0.65; 18 2.946,0; 19 2.946,0.65; 20 2.946,1.3; 21 2.946,1.95 | smd 0.305 x 0.813: 8 -1.95,-2.946; 9 -1.3,-2.946; 10 -0.65,-2.946; 11 0,-2.946; 12 0.65,-2.946; 13 1.3,-2.946; 14 1.95,-2.946; 22 1.95,2.946; 23 1.3,2.946; 24 0.65,2.946; 25 0,2.946; 26 -0.65,2.946; 27 -1.3,2.946; 28 -1.95,2.946 | smd 4.877 x 4.877: 29 0,0
0603 = smd 1.1 x 1: 1 -0.85,0; 2 0.85,0
2012 = smd 1.8 x 2.7: 1 -2.2,0; 2 2.2,0
TCXO = smd 1.3 x 1.1: E/D 1.15,0.95; GND -1.15,0.95; OSC -1.15,-0.95; VCC 1.15,-0.95
CON_702461401_MOL = drill 1.143 pad 1.499 square: 1 0,0 | drill 1.143 pad 1.499: 2 0,2.54; 3 2.54,0; 4 2.54,2.54; 5 5.08,0; 6 5.08,2.54; 7 7.62,0; 8 7.62,2.54; 9 10.16,0; 10 10.16,2.54; 11 12.7,0; 12 12.7,2.54; 13 15.24,0; 14 15.24,2.54
ATWINC15X0-MR210_MCH = smd 1.905 x 0.813: 1 7.365,-8.19; 2 7.365,-7.174; 3 7.365,-6.158; 4 7.365,-5.142; 5 7.365,-1.078; 6 7.365,0.954; 7 7.365,1.97; 8 7.365,2.986; 9 7.365,4.002; 10 -7.365,1.964; 11 -7.365,0.948; 12 -7.365,-0.068; 13 -7.365,-1.084; 14 -7.365,-2.1; 15 -7.365,-3.116; 16 -7.365,-4.132; 17 -7.365,-5.148; 18 -7.365,-6.164; 19 -7.365,-7.18 | smd 0.813 x 1.905: 20 -5.465,-10.86; 21 -2.417,-10.86; 22 -1.401,-10.86; 23 -0.385,-10.86; 24 0.631,-10.86; 25 1.647,-10.86; 26 2.663,-10.86; 27 3.679,-10.86; 28 4.695,-10.86 | smd 3.708 x 3.708: 29 -0.485,-4.59
DBT0038A_M = smd 1.6 x 0.3: 1 -3.05,4.5; 2 -3.05,4; 3 -3.05,3.5; 4 -3.05,3; 5 -3.05,2.5; 6 -3.05,2; 7 -3.05,1.5; 8 -3.05,1; 9 -3.05,0.5; 10 -3.05,0; 11 -3.05,-0.5; 12 -3.05,-1; 13 -3.05,-1.5; 14 -3.05,-2; 15 -3.05,-2.5; 16 -3.05,-3; 17 -3.05,-3.5; 18 -3.05,-4; 19 -3.05,-4.5; 20 3.05,-4.5; 21 3.05,-4; 22 3.05,-3.5; 23 3.05,-3; 24 3.05,-2.5; 25 3.05,-2; 26 3.05,-1.5; 27 3.05,-1; 28 3.05,-0.5; 29 3.05,0; 30 3.05,0.5; 31 3.05,1; 32 3.05,1.5; 33 3.05,2; 34 3.05,2.5; 35 3.05,3; 36 3.05,3.5; 37 3.05,4; 38 3.05,4.5
ARJM11C7-114-BA-EW2_ABR = drill 0.889 pad 1.397: 1 0,0; 2 1.27,-2.54; 3 2.54,0; 4 3.81,-2.54; 5 5.08,0; 6 6.35,-2.54; 7 7.62,0; 8 8.89,-2.54; 9 10.16,0; 10 11.43,-2.54 | drill 1.016 pad 1.524: 11 -1.016,8.89; 12 -1.016,10.922; 13 12.446,8.89; 14 12.446,10.922 | drill 1.702 pad 2.21: 15 -2.159,3.302; 16 13.589,3.302 | drill 3.251 pad 3.759: 17 0,6.35; 18 11.43,6.35
2PAD-11.5X4.8 = smd 5.5 x 2: P$1 -5,0; P$2 5,0
BARREL_CONN_EXTERN = smd 3.251 x 6.452: GND 5.08,3.81; POS -5.08,3.81
0805 = smd 1.3 x 1.5: 1 -0.95,0; 2 0.95,0
SMA_EDGELAUNCH = smd 4.064 x 1.524: GND@1 2.032,-2.54; GND@2 2.032,2.54 | smd 4.064 x 1.524 bottom: GND@3 2.032,2.54; GND@4 2.032,-2.54 | smd 4.064 x 1.27: P 2.032,0

### Placement (x,y rotation side)
10NH-ANT1  92.71,35.56 90 top
10NH-ANT2  92.71,12.7 90 top
!MSP_RST!_3V3  48.26,16.51 270 top
ANT1-ANT2\  93.98,33.02 90 top
ANT1-ANT2\1  90.17,10.16 90 top
ANT1-GND  91.44,33.02 0 top
ANT1-GND1  92.71,10.16 180 top
ANT2-ANT1  90.17,7.62 90 top
ANT2-ANT3  93.98,30.48 90 top
ANT2-GND  91.44,31.75 0 top
ANT2-GND1  91.44,30.48 0 top
ANT2-GND2  92.71,8.89 180 top
ANT2-GND3  92.71,7.62 180 top
C1  -8.89,-34.29 0 top  (outside the outline)
ETH  31.75,57.15 90 top
L2  -8.89,-31.75 0 top  (outside the outline)
LEDG  8.89,52.07 270 bottom
LEDY  8.89,71.12 90 bottom
LORA1  85.09,40.64 270 top
LORA2  85.09,17.78 270 top
OSC1-GND  49.53,74.93 90 bottom
OSC2-GND  39.37,74.93 90 bottom
R1  -8.89,-36.83 0 top  (outside the outline)
R2  77.47,74.93 0 top
R3  90.17,55.88 0 top
RBIAS-GNDCLOSE  64.77,54.61 90 top
RD-GND  60.96,51.65 270 top
RD-GND1  18.2,74.93 0 top
RD-GND2  86.36,52.07 180 top
RD-GND3  86.36,29.21 180 top
RD-GND4  90.17,58.42 180 top
RDM-GND  59.69,54.61 90 top
RDM-GND1  25.4,64.77 0 top
RDP-GND  62.23,54.61 90 top
RDP-GND1  25.4,67.31 0 top
RFI-GND  90.17,40.64 90 top
RFI-GND1  90.17,17.78 90 top
RFI-RFO  91.44,39.37 270 top
RFI-RFO1  91.44,16.51 270 top
RFO-33PF  93.98,36.83 90 top
RFO-33PF1  93.98,13.97 90 top
RFO-VR_PA  93.98,39.37 270 top
RFO-VR_PA1  93.98,16.51 270 top
TCT-3V3  16.51,72.39 180 top
TCXO1  86.36,48.26 0 top
TCXO2  86.36,25.4 0 top
TI-JTAG  34.29,30.48 90 top
U1  87.63,72.39 0 top
U3  48.26,22.86 90 top
U6  17.78,55.88 90 top
U$2  44.45,69.85 180 bottom
U$7  1.27,21.59 270 top
U$8  -1.27,2.54 0 top
VC2ETH-GND  19.05,50.8 90 top
VC2ETH-GNDC  20.32,50.8 270 top
VC2PETH-GND  24.13,62.23 180 top
VC2PETH-GNDC  26.67,62.23 180 top
VCAPCLOSE  31.75,53.34 90 top
VR_PA-PA_BOOST  92.71,40.64 270 top
VR_PA-PA_BOOST1  92.71,17.78 270 top
VSS-VDD_ETH  33.02,60.96 90 bottom
VSSOSC-VDDOSC  43.18,62.23 180 bottom
VSSPLL-VDDPLL  50.8,62.23 0 bottom
VSSRX-VDDRX  55.88,60.96 90 bottom
VSSTX-VDDTX  60.96,60.96 180 bottom
X1  99.06,27.94 180 top
X2  99.06,5.08 180 top

### Tracks (layer width: path | path; a pad name or v marks a point on that pad's centre or on a via)
3.3  (via drill 0.4 pad 0.08)
  Top 0.152: U3.38 43.09,26.58 42,26.58 v41.91,26.67
3.5  (via drill 0.4 pad 0.09)
  Top 0.152: U3.34 45.64,25.79 45.64,25.1 44.66,24.13 v41.91,24.13
3.6  (via drill 0.4 pad 0.09)
  Top 0.152: U3.33 46.14,25.79 46.14,25.1 43.9,22.86 v41.91,22.86
3.7  (via drill 0.4 pad 0.09)
  Top 0.152: U3.32 46.64,25.79 46.64,25.1 43.12,21.59 v41.91,21.59
3V3  (via drill 0.35)  (1 unrouted)
  Top 0.254: TCXO2.VCC 87.51,24.75 88.44,25.68 88.44,27.98 RD-GND3.1 | TCXO1.VCC 87.51,47.62 88.44,48.54 88.44,50.84 RD-GND2.1 | 48.26,18.36 U3.10
  Top 0.305: v13.97,72.39 TCT-3V3.2
  Top 0.406: R2.1 v74.93,74.93 | LORA1.1 87.04,43.86 v87.63,44.45 | LORA1.15 83.14,37.42 v82.55,36.83 | RD-GND3.1 87.21,30.06 v87.63,30.48 | U$7.POS 6.35,25.4 | U$7.POS 5.08,25.4 | U$7.POS 3.81,27.94
  Top 0.508: v88.9,24.13 87.83,24.13 TCXO2.VCC | LORA2.1 87.04,21 v87.63,21.59 | v82.28,14.97 82.45,14.97 82.58,14.83 LORA2.15 | !MSP_RST!_3V3.2 49.53,14.45 v49.53,13.97 | U1.20 82.17,58.8 v82.55,58.42
  Top 0.61: RD-GND2.1 v88.9,52.07 | TCXO1.VCC 87.83,46.99 v88.9,46.99 | v87.63,63.5 87.25,63.12 U1.23 87.25,60.54 86.83,60.12 86.79,60.12 v86.36,59.69
  Top 0.813: U$7.POS v8.89,26.67 | 7.62,27.94 v8.89,27.94 | v8.89,25.4 6.35,25.4 v6.35,24.13 | U$7.POS v5.08,29.21 | 6.35,27.94 v6.35,29.21 | U$7.POS v7.62,29.21 | U$7.POS v5.08,24.13 | U$7.POS v7.62,24.13 | 3.81,27.94 v3.81,29.21 | v3.81,24.13 3.81,25.4 | U$7.POS v2.54,24.13 | U$7.POS v2.54,29.21
  Bottom 0.152: VSS-VDD_ETH.2 33.02,63.5 ETH.28
  Bottom 0.254: VSSTX-VDDTX.2 64.77,63.92 ETH.15 | ETH.25 39.79,64.77 VSSOSC-VDDOSC.1 | VSSPLL-VDDPLL.1 51.65,64.35 ETH.20 | ETH.19 55.88,63.5 VSSRX-VDDRX.2
  other vias: 48.42,18.21
  pour Bottom: 95.32,77.36 95.28,77.34 79.98,77.34 79.94,77.36 79.9,77.4 79.88,77.44 79.88,83.69 1.4,83.69 1.4,1.4 97.66,1.4 97.66,83.69 95.38,83.69 95.38,77.44 95.36,77.4
5.0  (via drill 0.4 pad 0.08)
  Top 0.152: U3.37 44.14,26.03 44.14,26.72 43.05,27.81 42.04,27.81 v41.91,27.94
5.1  (via drill 0.4 pad 0.08)
  Top 0.152: U3.36 44.64,25.79 44.64,25.1 44.42,24.88 42.43,24.88 v41.91,25.4
!ATC_IRQ  (via drill 0.35)
  Top 0.203: U3.35 45.26,27.48 v45.72,27.94 | v77.47,71.12 77.66,71.31 U1.13
  Top 0.305: v50.8,31.75 v52.07,33.02
  Bottom 0.203: v50.8,31.75 49.53,30.48 49.53,30.22 47.25,27.94 v45.72,27.94 | v77.47,71.12 77.47,64.77 67.94,55.24 67.94,54.35 67.57,53.98 67.05,53.98 61.59,48.52 61.59,48 52.07,38.48 v52.07,33.02
!ATC_RST
  Top 0.254: U3.24 50.83,25.84 50.83,25.08 51.08,24.83 52.94,24.83 56.54,28.43 56.54,29.87 80.92,54.25 88.99,54.25 89.59,54.85 91.19,56.46 91.19,57.35 91.35,57.51 93.39,57.51 93.75,57.15 95.25,57.15 95.25,62.7 96.23,63.68 96.23,66.75 96.06,66.92 95.33,66.92 U1.4
!ETH_CHIPSEL  (via drill 0.35)
  Top 0.254: ETH.9 52.07,52.07 v49.53,49.53 | v43.18,48.26 43.48,47.96 43.48,38.1
  Top 0.305: U3.31 47.22,25.95 47.22,34.37 43.48,38.1 36.17,38.1 35.56,38.1 TI-JTAG.7
  Bottom 0.254: v49.53,49.53 48.26,48.26 v43.18,48.26
!ETH_IRQ  (via drill 0.35)
  Top 0.203: U3.26 49.76,27.18 50.16,27.58 50.16,28.57 49.53,29.2 v49.53,40.64 | v39.37,52.07 ETH.4
  Bottom 0.203: v49.53,40.64 39.37,50.8 v39.37,52.07
!ETH_RST  (via drill 0.35)
  Top 0.203: U3.27 49.36,26.01 49.36,27.28 49.53,27.45 v49.53,27.94 | v54.61,52.07 ETH.10
  Bottom 0.203: v49.53,27.94 51.43,29.84 51.43,48.89 v54.61,52.07
!MSP_RST  (via drill 0.35)
  Top 0.254: U3.9 47.76,17.8 | 47.2,17.3 !MSP_RST!_3V3.1 47.76,17.8 | v46.99,17.1 47.24,17.35 47.26,17.35 47.72,17.8 47.76,17.8
  Top 0.305: TI-JTAG.11 32.91,41.8 32.91,40.16 32.23,39.48 31.48,39.48 28.86,36.85 28.86,23.83 35.6,17.1 v43.18,17.1 | v46.99,17.1 47.2,17.3
  Bottom 0.305: v46.99,17.1 v43.18,17.1
ANT1
  Top 0.813: 92.71,34.8 ANT1-ANT2\.2 92.6,33.53 ANT1-GND.2 92.09,34.18 92.71,34.8 | 92.71,34.8 10NH-ANT1.1
ANT1-2
  Top 0.152: ANT1-GND1.2 91.84,10.16
  Top 0.254: 10NH-ANT2.1 91.33,10.67 | 91.33,10.67 ANT1-ANT2\1.2 | 91.84,10.16 91.33,10.67
ANT2
  Top 0.813: 93.22,31.75 ANT1-ANT2\.1 ANT2-ANT3.2 93.22,31.75 | 93.22,31.75 ANT2-GND.2
ANT2-2
  Top 0.254: ANT1-ANT2\1.1 90.93,8.89 | 90.93,8.89 ANT2-GND2.2 | 90.93,8.89 ANT2-ANT1.2
ATC_CHIPSEL
  Top 0.254: U3.23 51.26,27.47 51.46,27.67 51.46,31.14 54.61,34.29 54.61,37.17 75.22,57.78 75.22,63.95 79.53,68.26 U1.16
ATC_EN  (via drill 0.35)
  Top 0.254: U3.13 49.83,19.88 49.83,20.71 50.71,21.59 v53.34,21.59 | v85.09,59.69 85.7,60.3 85.73,60.3 86.23,60.79 U1.22
  Bottom 0.254: v53.34,21.59 54.27,21.59 85.09,52.41 v85.09,59.69
ATC_MISO
  Top 0.254: U1.17 79.94,66.91 79.2,66.91 76.49,64.21 76.49,55.6 53.53,32.63 53.53,28.45 52.26,27.18 U3.21
ATC_MOSI  (via drill 0.35)
  Top 0.254: U1.15 79.94,68.94 79.2,68.94 74.82,64.56 74.82,58.31 v55.88,39.37 | U3.20 55.88,29.03 v55.88,29.21
  Bottom 0.254: v55.88,39.37 v55.88,29.21
ATC_SCK  (via drill 0.35)
  Top 0.254: U1.18 79.94,65.9 79.2,65.9 79.03,65.73 79.03,56.17 55.21,32.35 55.21,29.81 v54.61,29.21 | U3.22 51.76,27.39 51.86,27.5 51.86,28.96 v52.12,29.21
  Bottom 0.254: v52.12,29.21 v54.61,29.21
ATC_SPI_CFG
  Top 0.813: R2.2 78.84,74.35 U1.10
ETH_CLK  (via drill 0.35)
  Top 0.305: v48.26,39.37 48.26,55.88 ETH.8 | U3.30 47.76,30 47.76,30.01 47.76,34.79 v46.99,35.56
  Bottom 0.305: v48.26,39.37 46.99,38.1 v46.99,35.56 | 46.99,37.08 v46.99,35.56 | v46.99,35.56 TI-JTAG.5
ETH_MISO  (via drill 0.35)
  Top 0.305: ETH.6 44.45,40.67 48.22,36.91 | U3.29 48.22,25.95 48.22,30.2 48.22,30.76 48.22,30.77 48.22,36.91 | v48.03,36.77 48.17,36.91 48.22,36.91
  Bottom 0.305: 46.84,34.44 47.67,35.28 47.67,36.41 v48.03,36.77 | 46.69,34.29 46.84,34.44 | 46.84,34.44 35.71,34.44 TI-JTAG.3
ETH_MOSI  (via drill 0.35)
  Top 0.305: U3.28 48.72,25.95 48.72,30.48 | ETH.7 46.99,38.78 48.72,37.05 48.72,30.48 | v48.9,30.48 48.72,30.48
  Bottom 0.305: TI-JTAG.1 35.56,30.48 35.89,30.48 v48.9,30.48
GND  (via drill 0.35)  (7 unrouted)
  Top 0.254: LORA2.26 87.82,18.21 87.51,18.21 87.08,17.78 v86.36,17.78 | v86.36,17.78 87,18.41 88.02,18.41 LORA2.26 | LORA2.26 87.82,18.65 87.51,18.65 87.11,19.05 v86.36,19.05 LORA2.29 | LORA2.22 87.04,15.83 v86.36,16.51 LORA2.29 | LORA2.29 v86.36,17.78 | LORA2.29 85.09,16.44 84.01,15.36 84.01,15.05 LORA2.16 83.79,16.48 v83.82,16.51 LORA2.29 | 84.48,17.78 LORA2.29 | 83.82,19.71 85.36,19.71 85.75,19.32 85.75,18.78 85.09,18.12 LORA2.29 | 85.51,27.94 85.51,26.65 TCXO2.GND | LORA2.8 82.48,19.73 | 82.48,19.73 83.16,19.05 83.16,20.7 LORA2.7 83.14,20.39 82.48,19.73 | U3.11 48.69,19.88 48.69,20.64 48.26,21.07 48.26,21.59
  Top 0.305: LORA1.16 83.79,39.34 v83.82,39.37 | 87.63,41.29 87.01,41.29 | LORA1.29 v86.36,41.91 | LORA1.29 v86.36,40.64 | LORA1.29 v86.36,39.37 | LORA1.8 83.23,42.59 | 83.23,42.59 83.52,42.88 83.82,42.88 v83.82,41.91 | 83.14,43.18 LORA1.7 LORA1.8 | 83.14,43.18 83.14,42.68 83.23,42.59 | LORA1.8 82.73,43.18 83.14,43.18
  Top 0.406: VCAPCLOSE.1 32.7,52.39 33.02,52.07
  Top 0.61: v86.36,39.37 86.8,39.37 87.44,38.73 88,38.73 LORA1.22 88.31,38.69 88.9,38.1 | LORA1.29 v83.82,41.91 | LORA1.29 v83.82,40.64 | LORA1.29 v85.09,41.91 | LORA1.29 v85.09,39.37 | LORA1.29 v83.82,39.37 | LORA1.29 85.09,39.55 | 93.98,7.62 ANT2-GND3.1 ANT2-GND2.1 | ANT2-GND2.1 93.98,8.89 | 93.98,10.16 ANT1-GND1.1 ANT2-GND2.1 | LORA2.8 81.87,19.73 81.28,20.32 | LORA2.7 82.55,21.32 82.55,21.59 | 16.51,63.5 U6.7 | 19.05,63.5 U6.7 | 17.78,62.23 U6.7 | 17.78,64.77 U6.7 | 35.56,40.64 TI-JTAG.9 | 34.29,39.41 TI-JTAG.9 | 34.29,41.87 TI-JTAG.9 | U6.16 13.97,69.98 13.97,71.12 15.24,71.12 15.24,70.23 U6.16 | U6.16 14.48,67.82 14.02,67.36 14.02,67.31 14.48,67.77 U6.16 | U6.16 16.13,69.47 16.51,69.85 14.86,69.85 U6.16 | U6.16 13.08,69.47 12.7,69.85 14.1,69.85 U6.16 | RFI-GND.2 90.43,40.89 90.66,40.89 90.72,40.83 91.44,40.83 91.12,41.15 RFI-GND.2 | RFI-GND.2 89.98,41.15 89.9,41.22 88.66,41.22 88.63,41.25 88.08,41.25 LORA1.26 87.63,41.29 | LORA2.22 88.31,15.83 88.9,15.24 | ANT1-GND.1 88.9,33.02 | ANT1-GND.1 90.79,33.67 90.17,34.29 | ANT1-GND.1 ANT2-GND.1 | ANT2-GND.1 90.17,31.75 | ANT2-GND.1 ANT2-GND1.1 | ANT2-GND1.1 90.17,30.48 | ANT2-GND1.1 90.79,29.83 90.17,29.21 | 91.44,17.97 91.25,17.97 90.93,18.29 RFI-GND1.2 88.9,18.29 88.8,18.39 88.08,18.39 LORA2.26 | 62.23,50.8 RD-GND.2 | 60.96,49.53 RD-GND.2 | 59.69,50.8 RD-GND.2 | 19.05,73.66 RD-GND1.2 | 20.32,74.93 RD-GND1.2 | RD-GND1.2 19.05,76.2 | RBIAS-GNDCLOSE.1 65.25,53.34 66.04,53.34 65.56,53.81 RBIAS-GNDCLOSE.1 | RBIAS-GNDCLOSE.1 64.3,53.34 63.5,53.34 63.98,53.81 RBIAS-GNDCLOSE.1 | RBIAS-GNDCLOSE.1 64.77,54.54 | 96.52,76.2 96.33,76.39 U1.9 94.84,76.24 93.85,76.24 93.81,76.2 92.71,76.2
  Top 0.61: 82.55,72.39 80.33,72.39 U1.12 78.81,72.32 78.74,72.39 | U1.28 92.89,60.96 93.98,60.96 | U1.28 92.33,63.12 92.71,63.5 | U1.28 92.71,61.15 92.71,59.69 | TCXO2.GND 84.89,26.67 83.82,26.67 | TCXO2.GND 85.53,26.67 86.36,26.67 | TCXO2.GND 85.21,25.58 85.09,25.46 | RD-GND3.2 83.82,29.21 | RD-GND3.2 85.51,27.94 | R3.2 93.98,55.88 | R3.2 92.71,55.54 92.71,53.34 | R3.2 91.1,54.61 90.17,54.61 | 91.44,59.69 91.44,58.84 RD-GND4.1 92.71,58.42 | RD-GND3.2 85.08,29.64 84.94,29.64 84.45,30.13 84.45,30.28
  Top 0.813: 87.01,41.29 v86.36,40.64 v85.09,39.37 84.38,38.66 | VCAPCLOSE.1 31.43,52.07 29.21,52.07 | VCAPCLOSE.1 31.75,50.8 | VCAPCLOSE.1 33.97,52.39 34.29,52.07 | 20.32,52.07 VC2ETH-GNDC.1 20.94,51.45 21.59,50.8 | U6.15 14.48,51.56 15.24,50.8 | U6.15 17.4,53.72 17.78,53.34 | U6.15 14.48,56.39 15.24,57.15 | U6.2 21.59,57.15 | U6.2 19.05,57.15 | U6.2 20.32,58.42 | U6.2 20.32,55.88 | VC2PETH-GNDC.1 27.32,62.88 27.94,63.5 | VC2PETH-GNDC.1 27.94,62.23 | VC2PETH-GNDC.1 27.32,60.31 27.94,59.69 | ETH.18 57.15,63.5 | 49.53,63.5 ETH.21 ETH.22 46.99,63.5 | ETH.11 57.15,58.42 | 34.29,58.42 ETH.2 34.29,54.61 | 85.09,53.34 85.09,52.49 RD-GND2.2 85.51,51.1 85.21,50.8 TCXO1.GND 84.89,49.53 83.82,49.53 | X1.GND@4 97.03,29.72 96.52,29.21 95.89,29.84 | X1.GND@3 96.52,25.91 96.52,26.67 | X1.GND@3 96.52,24.89 96.52,24.13 | X1.GND@3 93.98,25.4
  Top 1.27: X1.GND@4 97.03,32.51 v96.52,33.02 | U1.29 87.14,69.36 88.9,71.12 | U1.29 85.39,66.04 83.82,66.04 | U1.29 85.09,69.86 85.09,71.12 | U1.29 87.63,67.31 87.63,64.77 | U1.29 88.91,66.04 90.17,66.04 | U1.29 87.64,67.31 v88.9,67.31 | U1.29 89.19,69.85 90.17,69.85 | U1.29 87.92,68.58 90.17,68.58 | U1.29 v86.36,68.58 86.36,71.12 | U1.29 v86.36,68.58 83.82,68.58 | U1.29 86.66,67.31 83.82,67.31 | U1.29 86.36,67.02 86.36,64.77 | X2.GND@4 95.91,6.5 94.67,6.5 94.34,6.17 94.24,6.17 | X2.GND@4 96.52,8.13 v96.52,10.16 | X2.GND@4 95.25,7.62 95.25,8.89 | 95.25,3.66 95.4,3.66 96.52,2.54 X2.GND@3 v92.58,2.54
  Top 2.54: U$7.GND 2.29,16.51 | U$7.GND 5.08,17.77 4.55,18.3 4.55,19.05 | 6.36,16.51 U$7.GND | U$7.GND 5.08,15.25 4.55,14.72 4.55,13.97 | 8.89,13.44 8.15,14.18 | U$7.GND 8.89,16.51
  Bottom 0.152: VSS-VDD_ETH.1 33.02,58.42 ETH.2
  Bottom 0.254: VSSRX-VDDRX.1 55.88,58.42 ETH.11 | ETH.22 46.57,64.77 VSSOSC-VDDOSC.2 | VSSTX-VDDTX.1 57.15,63.92 ETH.18 | VSSPLL-VDDPLL.2 49.95,64.35 ETH.21 | X1.GND@4 96.52,30.99 v96.52,33.02
  Bottom 0.61: OSC2-GND.2 v39.37,77.47 | OSC1-GND.2 v49.53,77.47 | X2.GND@3 v92.58,2.54 | X1.GND@3 v92.71,25.4 | X2.GND@4 96.52,8.13 v96.52,10.16
  other vias: 85.09,16.51 85.09,17.78 85.09,19.05 85.09,40.64 83.82,19.05 83.82,17.78 87.63,68.58 86.36,67.31
  pour Top: 95.32,77.36 95.28,77.34 79.98,77.34 79.94,77.36 79.9,77.4 79.88,77.44 79.88,83.69 1.4,83.69 1.4,1.4 97.66,1.4 97.66,83.69 95.38,83.69 95.38,77.44 95.36,77.4
LEDGN
  Bottom 0.152: ETH.27 34.29,66.04 30.48,69.85 17.78,69.85 6.86,58.93 U6.12
LEDYN
  Bottom 0.152: U6.14 7.07,68.33 10.45,64.95 12.41,64.95 17.97,70.51 31.09,70.51 ETH.26
LORA1_CHIPSEL  (via drill 0.35)
  Top 0.254: U3.19 68.07,19.81 v80.01,31.75 | v86.4,35.56 v86.39,35.57 LORA1.20
  Bottom 0.254: v80.01,31.75 82.55,31.75 86.36,35.56 v86.4,35.56
LORA1_IRQ  (via drill 0.35)
  Top 0.203: U3.2 44.26,12.94 44.33,12.87
  Top 0.254: v44.49,12.7 44.33,12.87 | v81.21,41.95 v81.21,41.94 LORA1.9
  Bottom 0.254: v44.49,12.7 45.77,12.7 48.3,15.24 54.61,15.24 81.21,41.84 v81.21,41.95
LORA1_IRQ2
  Top 0.254: U3.1 43.83,19.88 43.83,20.64 47.62,24.42 53.11,24.42 56.94,28.26 56.94,29.7 68.53,41.29 LORA1.10
LORA1_MISO
  Top 0.254: U3.16 51.33,19.74 51.33,18.83 52.24,17.92 68.58,17.92 68.72,17.78 69.85,17.78 85.09,33.02 LORA1.18
LORA1_MOSI  (via drill 0.35)
  Top 0.254: U3.17 51.83,19.74 51.83,18.91 52.41,18.32 69.12,18.32 v81.28,30.48 | LORA1.19 85.74,31.13 85.29,30.68 v85.29,30.48
  Bottom 0.254: v85.29,30.48 v81.28,30.48
LORA1_RST  (via drill 0.35)
  Top 0.203: U3.3 44.76,19.04 44.68,18.96 44.68,14.2 v44.99,13.89
  Top 0.254: v83.82,45.72 83.82,43.62 LORA1.6
  Bottom 0.203: v44.99,13.89 46.72,15.62 53.99,15.62 80.94,42.58
  Bottom 0.254: 80.94,42.58 83.82,45.45 v83.82,45.72
LORA1_SCK
  Top 0.254: U3.18 52.33,19.74 52.33,18.98 52.58,18.73 68.26,18.73 84.44,34.91 LORA1.17
LORA2_CHIPSEL  (via drill 0.35)
  Top 0.305: v87.63,12.7 86.39,13.94 LORA2.20 | U3.7 46.76,18.74 46.31,18.29 46.31,16.81 46.71,16.41 50.16,16.41 52.34,14.23 52.6,13.97 v80.01,13.97
  Bottom 0.305: v87.63,12.7 81.28,12.7 v80.01,13.97
LORA2_IRQ
  Top 0.254: U3.15 50.8,19.77 50.8,16.51 52.91,14.4 77.16,14.4 81.62,18.86 81.92,18.86 LORA2.9
LORA2_IRQ2  (via drill 0.35)
  Top 0.254: U3.14 50.33,19.88 50.33,20.64 50.58,20.89 66.61,20.89 v67.31,21.59 | LORA2.10 81.92,18.21 81.62,18.21 80.01,16.6 v80.01,15.24
  Bottom 0.254: v67.31,21.59 73.66,21.59 v80.01,15.24
LORA2_MISO
  Top 0.254: LORA2.18 84.87,14.62 84.87,12.82 81.55,9.5 50.31,9.5 45.06,14.75 45.06,18.8 45.26,19 U3.4
LORA2_MOSI  (via drill 0.35)
  Top 0.254: U3.5 45.76,18.93 45.47,18.64 45.47,14.92 50.23,10.16 v81.28,10.16 | v86.36,10.16 85.74,10.78 LORA2.19
  Bottom 0.254: v81.28,10.16 v86.36,10.16
LORA2_RST  (via drill 0.35)
  Top 0.203: U3.25 50.36,26.01 50.36,26.73 50.8,27.17 v50.8,27.94 | v71.12,25.4 59.69,25.4 v57.62,27.48
  Top 0.305: LORA2.6 83.79,22.83 v83.82,22.86
  Bottom 0.203: v83.82,22.86 82.55,24.13 72.39,24.13 v71.12,25.4 | v50.8,27.94 57.15,27.94 v57.62,27.48
LORA2_SCK
  Top 0.254: U3.6 46.26,18.85 45.88,18.47 45.88,15.09 49.53,11.43 82.21,11.43 84.22,13.44 84.22,14.62 LORA2.17
MSP_TEST  (via drill 0.35)
  Top 0.254: U3.8 47.26,18.28 v46.99,18.01
  Top 0.305: TI-JTAG.8 31.38,38.1 29.32,36.04 29.32,24.13 35.67,17.78 43.18,17.78 v43.18,18.01
  Bottom 0.305: v43.18,18.01 v46.99,18.01
N$1
  Top 0.152: 92.82,36.32 10NH-ANT1.2
  Top 0.254: RFO-33PF.1 92.82,36.32
N$2
  Top 0.152: 92.82,13.46 10NH-ANT2.2
  Top 0.254: 92.82,13.46 RFO-33PF1.1
N$4
  Top 0.813: ETH.1 VCAPCLOSE.2
N$5
  Top 0.61: VC2ETH-GND.1 VC2ETH-GNDC.2
N$6
  Top 0.813: VC2PETH-GND.1 VC2PETH-GNDC.2
N$7
  Bottom 0.813: U6.13 LEDY.1
N$8
  Top 0.254: RDM-GND.1 60.96,53.96 | 60.96,53.96 RDP-GND.1 | 60.96,53.96 60.96,53.34 | 60.96,53.34 RD-GND.1 60.96,52.69 | RDM-GND.1 60.96,52.69 | RDP-GND.1 60.96,52.69 | RDP-GND.1 61.58,53.96 60.96,53.34 | RDM-GND.1 60.34,53.96 60.96,53.34
N$9
  Bottom 0.813: U6.11 LEDG.1
N$10
  Top 0.813: RBIAS-GNDCLOSE.2 ETH.14
N$11  (1 unrouted)
  Top 0.254: ANT2-ANT3.1 93.98,29.94
  Top 0.61: 95.98,27.94 95.98,27.97 ANT2-ANT3.1 93.61,29.97 93.45,30.13
  Top 0.813: 95.98,27.94 96.52,27.94 | ANT2-GND1.2 93.1,30.48 93.45,30.13
N$13
  Top 0.813: R3.1 87.97,57.07 RD-GND4.2 88.26,59.48 U1.24
N$18
  Top 0.254: ANT2-ANT1.1 90.68,7.62 ANT2-GND3.2
  Top 0.61: X2.P 92.2,5.08 ANT2-ANT1.1
OSC1_ETH
  Bottom 0.152: 49.45,69.77 U$2.P$2 49.53,69.93
  Bottom 0.254: ETH.23 49.45,69.77 | 49.53,69.93 OSC1-GND.1
OSC2_ETH
  Bottom 0.152: U$2.P$1 39.37,69.93
  Bottom 0.254: ETH.24 39.45,67.23 U$2.P$1 | 39.37,69.93 OSC2-GND.1
PA_BOOST
  Top 0.254: VR_PA-PA_BOOST.1 91.92,41.94 LORA1.27
PA_BOOST2
  Top 0.254: VR_PA-PA_BOOST1.1 91.92,19.08 LORA2.27
RD_N
  Top 0.254: RDM-GND.2 ETH.12
  Bottom 0.254: U6.3 22.86,58.42 24.74,56.54 arc90 25.19,56.54 27.84,59.19 arc-90 28.29,59.19 28.69,58.8 arc-90 28.69,58.35 26.04,55.69 arc90 26.04,55.24 26.67,54.61 57.15,54.61 ETH.12
RD_P
  Top 0.254: RDP-GND.2 ETH.13
  Bottom 0.254: U6.5 17.78,59.4 17.38,59.4 16.8,58.83 16.8,58.02 17.38,57.44 17.78,57.44 17.78,57.15 18.07,56.86 18.18,56.86 18.76,56.28 18.76,56.17 21.59,53.34 58.42,53.34 ETH.13
RFI
  Top 0.152: 91.33,40.13 RFI-RFO.1
  Top 0.254: 91.33,40.13 RFI-GND.1 89.66,40.64 LORA1.25
RFI2
  Top 0.152: 91.33,17.27 RFI-RFO1.1
  Top 0.254: 91.33,17.27 RFI-GND1.1 89.74,17.7 88.66,17.7 88.58,17.78 LORA2.25
RFO
  Top 0.152: 93.84,38.72 RFO-VR_PA.2
  Top 0.254: 93.84,38.72 RFI-RFO.2 90.61,39.55 89.75,39.55 89.32,39.99 LORA1.24 | RFO-33PF.2 RFO-VR_PA.2
RFO2
  Top 0.152: RFI-RFO1.2 91.58,16
  Top 0.254: 91.58,16 RFO-VR_PA1.2 RFO-33PF1.2 | LORA2.24 89.32,17.13 89.75,16.69 90.61,16.69 RFI-RFO1.2
TD_C
  Top 0.254: RDP-GND1.1 24.34,67.31 23.36,66.33 18.07,66.33 U6.9 23.48,66.04 RDM-GND1.1
  Top 0.305: RD-GND1.1 TCT-3V3.1 17.36,66.46 U6.9
TD_N
  Top 0.254: U6.8 24.12,64.77 24.12,64.2 24.28,64.04 25.22,64.04 25.38,64.2 25.38,64.77 RDM-GND1.2 27.32,66.04 60.96,66.04 ETH.16
TD_P  (via drill 0.35)
  Top 0.254: U6.10 22.4,67.31 22.75,67.67 24.12,67.67 24.12,67.88 24.28,68.04 25.22,68.04 25.38,67.88 25.38,67.31 RDP-GND1.2 52.07,67.31 arc90 52.39,67.63 52.39,68.53 arc-90 52.7,68.85 52.92,68.85 arc-90 53.24,68.53 53.24,67.63 arc90 53.56,67.31 v57.15,67.31
  Bottom 0.254: ETH.17 v57.15,67.31
VC2ETH
  Top 0.813: U6.1 19.05,54.61 VC2ETH-GND.2
VC2PETH
  Top 0.813: U6.6 VC2PETH-GND.2
VR_ANA  (1 unrouted)
VR_DIG  (1 unrouted)
VR_PA
  Top 0.152: 92.96,39.88 VR_PA-PA_BOOST.2
  Top 0.254: 92.96,39.88 RFO-VR_PA.1 93.46,40.4 93.46,42.59 LORA1.28
VR_PA2
  Top 0.152: VR_PA-PA_BOOST1.2 92.96,17.02
  Top 0.254: 92.96,17.02 RFO-VR_PA1.1 93.29,17.71 93.29,18.7 92.26,19.73 LORA2.28
XTA1
  Top 0.254: LORA1.4 85.09,47.19 TCXO1.OSC
XTA2
  Top 0.254: LORA2.4 85.09,24.33 TCXO2.OSC

### Text on the board
tNames: ATWINC1500 | TI-JTAG | LoRa Receive | MSP430 | LoRa Send | Magic WiFi 1.0
bNames: 25MHz